# EasyEDA Pro project ad831.eprj

# Schematic Schematic1
Board Name: Board1; Create Date: 2025-07-05; Page Name: P1; Project Name: ad831; Schematic Name: Schematic1; Update Date: 2025-07-06; Company: 嘉立创EDA; Page Size: A4; Version: V1.0
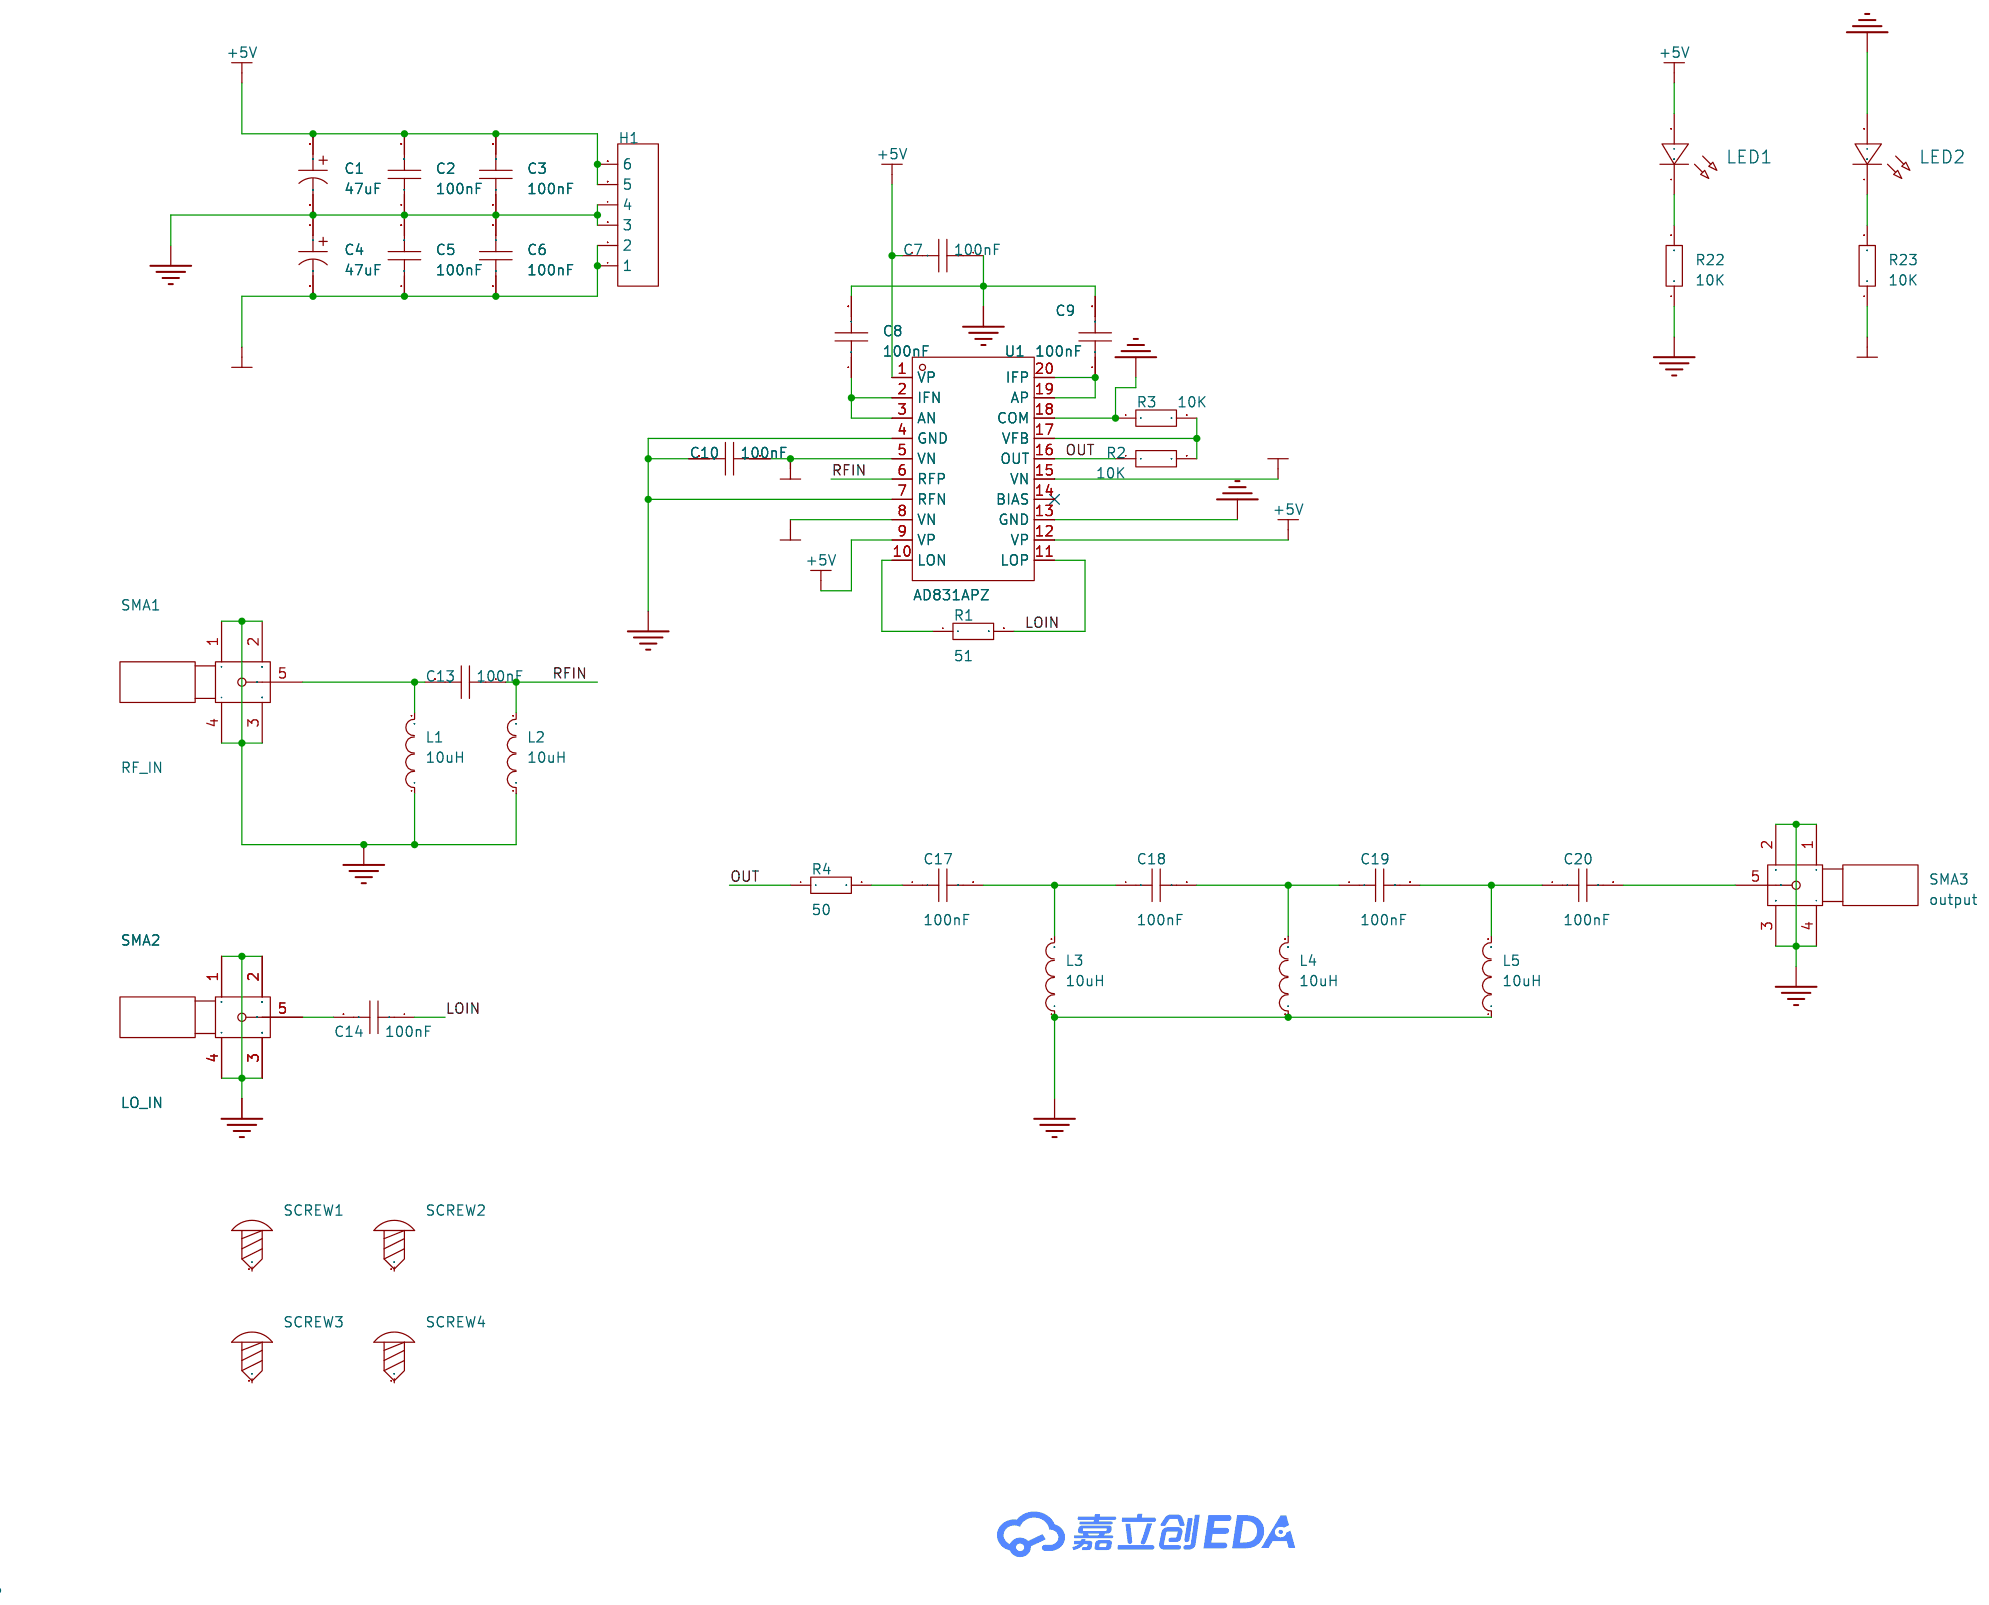
[diagram p0: schematic sheet]

## Parts
C1  47uF  [CAP-TH_BD6.3-P2.50-D0.5-FD]
C2  100nF  [C0603]
C3  100nF  [C0603]
C4  47uF  [CAP-TH_BD6.3-P2.50-D0.5-FD]
C5  100nF  [C0603]
C6  100nF  [C0603]
C7  100nF  [C0603]
C8  100nF  [C0603]
C9  100nF  [C0603]
C10  100nF  [C0603]
C13  100nF  [C0603]
C14  100nF  [C0603]
C17  100nF  [C0603]
C18  100nF  [C0603]
C19  100nF  [C0603]
C20  100nF  [C0603]
H1  -  [HDR-TH_6P-P2.54-V-M-1]
L1  10uH  [L0603]
L2  10uH  [L0603]
L3  10uH  [L0603]
L4  10uH  [L0603]
L5  10uH  [L0603]
LED1  -  [LED_0603]
LED2  -  [LED_0603]
R1  51  [R0603]
R2  10K  [R0603]
R3  10K  [R0603]
R4  50  [R0603]
R22  10K  [R0603]
R23  10K  [R0603]
SCREW1  -  [M2螺丝]
SCREW2  -  [M2螺丝]
SCREW3  -  [M2螺丝]
SCREW4  -  [M2螺丝]
SMA1  RF_IN  [SMA-SMD_BWSMA-KE-P001]
SMA2  LO_IN  [SMA-SMD_BWSMA-KE-P001]
SMA3  output  [SMA-SMD_BWSMA-KE-P001]
U1  AD831APZ  [PLCC-20_L9.0-W9.0-P1.27-LS10.0-T]

## Library data of the parts
C1 C4 = CD26G1HM470E120T: 容值:47uF;精度:±20%;额定电压:50V;纹波电流:234mA@100kHz;等效串联电阻(ESR):710mΩ@100kHz;; LCSC Part Name: 长寿命耐高纹波耐高温，5000H-80000H at 105℃ 47uF ±20% 50V; Supplier Part: C42460502; Manufacturer: 创慧电子; Supplier Footprint: 插件,D6.3xL12mm; Datasheet: https://atta.szlcsc.com/upload/public/pdf/source/20250208/95E25F66E0D5629BBC6A4318C6E986E6.pdf; Supplier: LCSC; Tolerance: ±20%; Voltage Rating: 50V; Ripple Current: 234mA@100kHz; Equivalent Series Resistance(ESR): 710mΩ@100kHz; Pin Spacing: 2.5mm; Diameter: 6.3mm; Height - Seated (Max): 12mm; Lifetime: 8000hrs@105℃; Operating Temperature: -40℃~+105℃
C2 C3 C5-C10 C13 C14 C17-C20 = CAP_0603: Supplier Footprint: 0603
H1 = HDR-M_2.54_1x6P: Supplier Part: C37208; Supplier Footprint: 插件
L1-L5 = L_0603
LED1 LED2 = LED_0603-R: Supplier Footprint: 0603
R1-R4 R22 R23 = Res_0603: Supplier Footprint: 0603
SCREW1-SCREW4 = M2螺丝: Supplier Footprint: 插件
SMA1-SMA3 = SMA: Supplier Part: C9900018296; JLCPCB Part Class: 扩展库; Supplier: LCSC
U1 = AD831APZ: Supplier Part: C652692; Manufacturer: ADI(亚德诺); Supplier Footprint: PLCC-20(9x9); JLCPCB Part Class: 扩展库; Datasheet: https://atta.szlcsc.com/upload/public/pdf/source/20200819/C652692_AA923ED7C1CF51416EE639A17D0D84AF.pdf; Supplier: LCSC; Applications: HF,VHF; Frequency Range: 500MHz; Gain: 0dB; Noise Figure: 14dB; Supply Voltage: 4.5V~5.5V; Supply Current: 125mA

## Nets
+5V: C1.1 C2.2 C3.2 C7.2 H1.5 H1.6 LED1.2(A) U1.1(VP) U1.9(VP) U1.12(VP)
-5V: C4.2 C5.1 C6.1 C10.1 H1.1 H1.2 R23.1 U1.5(VN) U1.8(VN) U1.15(VN)
GND: C1.2 C2.1 C3.1 C4.1 C5.2 C6.2 C7.1 C8.2 C9.2 C10.2 H1.3 H1.4 L1.1 L2.1 L3.1 L4.1 L5.1 LED2.2(A) R3.1 R22.1 SMA1.1 SMA1.2 SMA1.3 SMA1.4 SMA2.1 SMA2.2 SMA2.3 SMA2.4 SMA3.1 SMA3.2 SMA3.3 SMA3.4 U1.4(GND) U1.7(RFN) U1.13(GND) U1.18(COM)
LOIN: C14.1 R1.2 U1.11(LOP)
OUT: R2.1 R4.1 U1.16(OUT)
RFIN: C13.1 L2.2 U1.6(RFP)
$1N918: C9.1 U1.19(AP) U1.20(IFP)
$1N932: C8.1 U1.2(IFN) U1.3(AN)
$1N1386: R1.1 U1.10(LON)
$1N1504: C13.2 L1.2 SMA1.5
$1N1814: C14.2 SMA2.5
$1N2089: R2.2 R3.2 U1.17(VFB)
$1N2362: C19.2 C20.1 L5.2
$1N2376: C18.2 C19.1 L4.2
$1N2391: C17.2 C18.1 L3.2
$1N2521: C20.2 SMA3.5
$1N2573: C17.1 R4.2
$1N2655: LED1.1(C) R22.2
$1N2734: LED2.1(C) R23.2

Not connected (* = marked no-connect by the designer): SCREW1 1; SCREW2 1; SCREW3 1; SCREW4 1; U1 14(BIAS)*

# Board PCB1
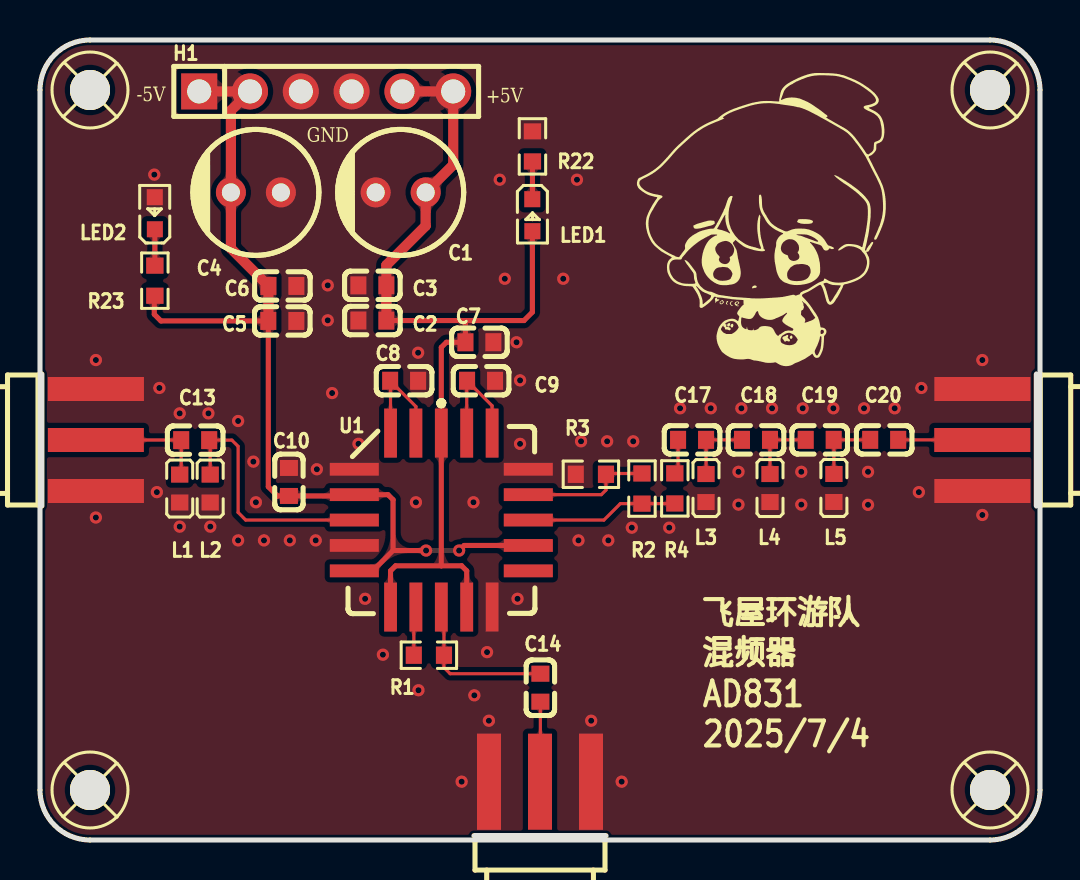
[diagram p1: board, top side]
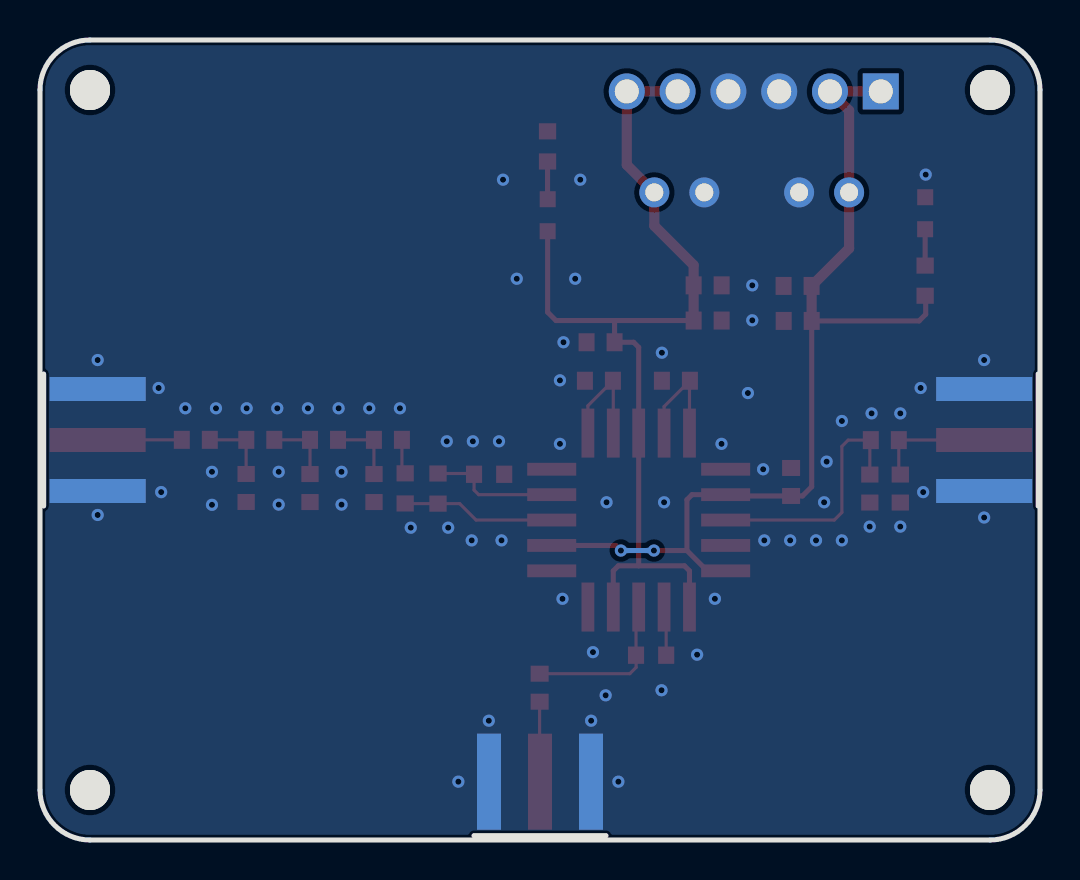
[diagram p2: board, bottom side, seen from below]

Outline 50 x 40 mm; copper layers: Top Layer, Bottom Layer. Coordinates in mm from the lower left corner of the outline.
Outline path: 0,37.5 0,2.5 arc(0.73,0.73) 2.5,0 47.5,0 arc(49.27,0.73) 50,2.5 50,37.5 arc(49.27,39.27) 47.5,40 2.5,40 arc(0.73,39.27) 0,37.5
Stack: Top Layer 0.035mm / Dielectric1 1.51mm FR4 er 4.5 / Bottom Layer 0.035mm

## Design rules (mm)
template: 自定义配置
spacing copperThickness1oz (default): track to track 0.102, other pairs 0.152 to 0.3
spacing copperThickness2oz: track to track 0.203, other pairs 0.152 to 0.3
track width copperThickness1oz (default): min 0.127, default 0.254, max 2.54
track width copperThickness2oz: min 0.203, default 0.254, max 2.54
differential pair differentialPair (default): width min 0.127, default 0.254, max 2.54; gap min 0.152, default 0.152
via viaSize (default): diameter min 0.5, default 0.61, max 10; hole min 0.3, default 0.305, max 6.3
pour e303 uses main
pour e316 uses main

## Placement (name value [footprint] x y rotation side)
C1  47uF  [CAP-TH_BD6.3-P2.50-D0.5-FD]  18.03 32.38 180 top
C2  100nF  [C0603]  16.62 25.97 0 top
C3  100nF  [C0603]  16.62 27.73 0 top
C4  47uF  [CAP-TH_BD6.3-P2.50-D0.5-FD]  10.79 32.38 180 top
C5  100nF  [C0603]  12.12 25.95 0 top
C6  100nF  [C0603]  12.12 27.7 0 top
C7  100nF  [C0603]  21.97 24.89 180 top
C8  100nF  [C0603]  18.21 22.96 0 top
C9  100nF  [C0603]  22.05 22.96 0 top
C10  100nF  [C0603]  12.45 17.9 90 top
C13  100nF  [C0603]  7.76 19.99 180 top
C14  100nF  [C0603]  25.02 7.61 270 top
C17  100nF  [C0603]  32.6 20.01 0 top
C18  100nF  [C0603]  35.8 20.01 0 top
C19  100nF  [C0603]  38.99 20.01 0 top
C20  100nF  [C0603]  42.21 20.01 0 top
H1  -  [HDR-TH_6P-P2.54-V-M-1]  14.31 37.43 0 top
L1  10uH  [L0603]  6.98 17.57 90 top
L2  10uH  [L0603]  8.51 17.57 90 top
L3  10uH  [L0603]  33.3 17.6 90 top
L4  10uH  [L0603]  36.5 17.6 90 top
L5  10uH  [L0603]  39.69 17.6 90 top
LED1  -  [LED_0603]  24.62 31.19 270 top
LED2  -  [LED_0603]  5.73 31.39 90 top
R1  51  [R0603]  19.44 9.24 0 top
R2  10K  [R0603]  30.1 17.57 90 top
R3  10K  [R0603]  27.54 18.29 0 top
R4  50  [R0603]  31.74 17.58 90 top
R22  10K  [R0603]  24.62 34.68 270 top
R23  10K  [R0603]  5.74 27.97 90 top
SCREW1  -  [M2螺丝]  2.5 37.5 0 top
SCREW2  -  [M2螺丝]  47.5 37.5 0 top
SCREW3  -  [M2螺丝]  2.5 2.5 0 top
SCREW4  -  [M2螺丝]  47.5 2.5 0 top
SMA1  RF_IN  [SMA-SMD_BWSMA-KE-P001]  2.79 20 180 top
SMA2  LO_IN  [SMA-SMD_BWSMA-KE-P001]  25 2.92 270 top
SMA3  output  [SMA-SMD_BWSMA-KE-P001]  47.12 20 0 top
U1  AD831APZ  [PLCC-20_L9.0-W9.0-P1.27-LS10.0-T]  20.07 16 0 top

## Footprints (pads in the part's own frame, mm; a bottom-side part is the same pattern mirrored in y, then rotated)
C0603
  rect 0.8x0.9 smd: 1(-0.7,0) 2(0.7,0)
CAP-TH_BD6.3-P2.50-D0.5-FD
  round 1.5 hole 0.9: 1(-1.25,0) 2(1.25,0)
HDR-TH_6P-P2.54-V-M-1
  rect 1.8x1.8 hole 1.2: 1(-6.35,0)
  round 1.8 hole 1.2: 2(-3.81,0) 3(-1.27,0) 4(1.27,0) 5(3.81,0) 6(6.35,0)
L0603
  rect 0.8x0.864 smd: 1(-0.7,0) 2(0.7,0)
LED_0603
  rect 0.8x0.8 smd: 1(-0.851,-0.01) 2(0.75,-0.005)
M2螺丝
  round 2 hole 2: 1(0,0)
PLCC-20_L9.0-W9.0-P1.27-LS10.0-T
  rect 0.64x2.45 smd: 1(0,4.348) 2(-1.27,4.348) 3(-2.54,4.348) 9(-2.54,-4.348) 10(-1.27,-4.348) 11(0,-4.348) 12(1.27,-4.348) 13(2.54,-4.348) 19(2.54,4.348) 20(1.27,4.348)
  rect 2.45x0.64 smd: 4(-4.348,2.54) 5(-4.348,1.27) 6(-4.348,0) 7(-4.348,-1.27) 8(-4.348,-2.54) 14(4.348,-2.54) 15(4.348,-1.27) 16(4.348,0) 17(4.348,1.27) 18(4.348,2.54)
R0603
  rect 0.806x0.864 smd: 1(-0.753,0) 2(0.753,0)
SMA-SMD_BWSMA-KE-P001
  rect 4.8x1.2 smd: 1(0,-2.55) 2(0,2.55) 5(0,0)
  rect 4.8x1.2 smd far side: 3(0,2.55) 4(0,-2.55)

## Nets
As in the schematic.

Pads without a net: SCREW1 1; SCREW2 1; SCREW3 1; SCREW4 1; U1 14

## Via types
v1: diameter 0.61, hole 0.305, Top Layer to Bottom Layer, 68 vias

## Routing (per net, layer and track width the routed paths; a pad name or vN(x,y) marks a point on that pad's centre or on a via; arc(x,y) is an arc through that point)
+5V: length 47.9
  Top Layer w0.254: U1.9 17.53,13.46 17.78,13.71 20.07,13.71 ; 21.27,25.97 C7.2 20.32,24.89 20.07,24.63 U1.1 20.07,13.71 ; 21.27,25.97 C2.2 ; 21.27,25.97 24.2,25.97 24.62,26.39 LED1.2 ; 20.07,13.71 21.08,13.71 21.34,13.46 U1.12
  Top Layer w0.508: C3.2 17.32,28.74 19.28,30.71 C1.1 20.66,33.76 H1.6 H1.5 ; 17.32,27.73 C2.2
-5V: length 48.6
  Top Layer w0.254: 17.65,14.47 17.65,17.01 17.4,17.27 U1.5 15.65,17.2 C10.1 11.88,17.2 11.42,17.66 C5.1 6.05,25.95 5.72,26.28 5.72,27.18 R23.1 ; 17.65,14.47 v1(19.3,14.47) ; 17.65,14.47 16.64,13.46 U1.8 ; U1.15 21.21,14.73 v1(20.96,14.47)
  Top Layer w0.508: H1.1 H1.2 9.54,36.47 C4.2 9.54,29.58 C6.1 11.42,25.96 C5.1
  Bottom Layer w0.254: v1(19.3,14.47) v1(20.96,14.47)
GND:
  vias: v1(2.79,24) v1(2.79,16.12) v1(5.72,33.27) v1(5.84,17.39) v1(5.97,22.6) v1(6.98,21.33) v1(6.99,15.67) v1(8.42,21.33) v1(8.52,15.67) v1(9.91,20.95) v1(9.91,14.98) v1(10.67,18.92) v1(10.79,16.89) v1(11.2,14.98) v1(12.49,14.98) v1(13.84,18.54) v1(13.79,14.98) v1(14.39,27.73) v1(14.39,25.98) v1(14.6,22.35) v1(15.92,19.81) v1(16.26,12.06) v1(17.15,9.27) v1(18.8,16.89) v1(18.91,24.36) v1(18.92,7.49) v1(21.08,2.92) v1(21.67,16.89) v1(21.72,7.23) v1(22.35,9.39) v1(22.44,5.96) v1(22.99,33.02) v1(23.24,28.06) v1(23.83,24.89) v1(23.88,12.06) v1(24,22.98) v1(24,19.81) v1(26.16,28.06) v1(26.85,33.02) v1(26.92,14.98) v1(27.05,19.93) v1(27.56,5.96) v1(28.36,19.93) v1(28.41,14.98) v1(29.08,2.92) v1(29.59,15.62) v1(29.66,19.93) v1(31.46,15.62) v1(32,21.58) v1(33.54,21.58) v1(34.93,18.41) v1(34.92,16.77) v1(35.07,21.58) v1(36.6,21.58) v1(38.14,21.58) v1(38.06,18.41) v1(38.06,16.77) v1(39.67,21.58) v1(41.2,21.58) v1(41.4,18.41) v1(41.4,16.76) v1(42.73,21.58) v1(43.94,17.39) v1(44.07,22.6) v1(47.12,24) v1(47.12,16.25)
LOIN: length 8
  Top Layer w0.158: C14.1 20.51,8.31 20.19,8.63 20.19,9.23 R1.2 20.2,11.52 U1.11
OUT: length 7.7
  Top Layer w0.158: U1.16 28.19,16 29.02,16.82 R2.1 31.73,16.82 R4.1
RFIN: length 12.6
  Top Layer w0.158: L2.2 8.51,19.94 C13.1 9.59,19.99 9.91,19.68 9.91,16.38 10.29,16 U1.6
$1N918: length 5.8
  Top Layer w0.158: U1.20 21.34,22.94 C9.1 22.61,21.71 U1.19
$1N932: length 5.7
  Top Layer w0.158: U1.2 18.8,21.67 17.53,22.94 ; 17.53,22.94 U1.3 ; 17.53,22.94 C8.1
$1N1386: length 2.5
  Top Layer w0.158: U1.10 18.69,11.54 R1.1
$1N1504: length 6
  Top Layer w0.158: L1.2 7.06,18.35 C13.2 7.05,20 SMA1.5
$1N1814: length 4
  Top Layer w0.158: SMA2.5 25.02,2.94 25.02,6.92
$1N2089: length 6.6
  Top Layer w0.158: 30.1,18.33 28.34,18.33 R3.2 28.3,17.5 28.07,17.27 U1.17
$1N2362: length 3.5
  Top Layer w0.158: C20.1 C19.2 39.69,20 39.69,18.3
$1N2376: length 3.5
  Top Layer w0.158: 38.28,20.01 C18.2 36.5,18.3
$1N2391: length 3.5
  Top Layer w0.158: C18.1 C17.2 33.3,18.3 L3.2
$1N2521: length 4.2
  Top Layer w0.158: C20.2 47.11,20.01 SMA3.5
$1N2573: length 1.7
  Top Layer w0.158: R4.2 31.9,18.5 C17.1
$1N2655: length 1.9
  Top Layer w0.254: R22.2 24.62,32.05 LED1.1
$1N2734: length 1.8
  Top Layer w0.254: R23.2 LED2.1

## Copper pours and planes (outline as drawn; the poured copper is in the pictures)
GND on Top Layer: -4.7,42.41 54.48,42.41 54.48,-3.43 -4.7,-3.43
GND on Bottom Layer: -2.54,41.27 52.83,41.27 52.83,-1.4 -2.54,-1.4

Small or netless copper shapes (teardrops, artwork), in the pictures only: 90 on Top Layer, 2 on Bottom Layer

## Text on the board
Top Silkscreen Layer: -5V | GND | +5V | 飞屋环游队 / 混频器 / AD831 / 2025/7/4
